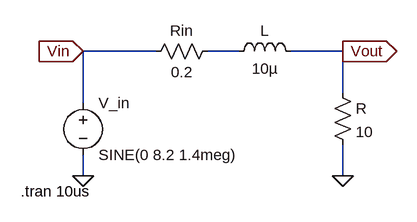
[diagram p0: schematic lab1.asc]
lab1.asc, the LTspice schematic file:
Version 4
SHEET 1 880 680
WIRE 160 16 48 16
WIRE 288 16 240 16
WIRE 448 16 368 16
WIRE 448 80 448 16
WIRE 48 96 48 16
WIRE 48 208 48 176
WIRE 448 208 448 160
FLAG 448 208 0
FLAG 48 208 0
FLAG 48 16 Vin
IOPIN 48 16 In
FLAG 448 16 Vout
IOPIN 448 16 Out
SYMBOL voltage 48 80 R0
WINDOW 123 0 0 Left 0
WINDOW 39 0 0 Left 0
SYMATTR InstName V_in
SYMATTR Value SINE(0 8.2 1.4meg)
SYMBOL res 256 0 R90
WINDOW 0 0 56 VBottom 2
WINDOW 3 32 56 VTop 2
SYMATTR InstName Rin
SYMATTR Value 0.2
SYMBOL res 432 64 R0
SYMATTR InstName R
SYMATTR Value 10
SYMBOL ind 272 32 R270
WINDOW 0 32 56 VTop 2
WINDOW 3 5 56 VBottom 2
SYMATTR InstName L
SYMATTR Value 10µ
TEXT -48 232 Left 2 !.tran 10us

The netlist it stands for:
* lab1.asc
V_in Vin 0 SINE(0 8.2 1.4meg)
Rin N001 Vin 0.2
R Vout 0 10
L N001 Vout 10µ
.tran 10us
.backanno
.end